# EAGLE design BrewPi Shield (EAGLE 9.4.2)
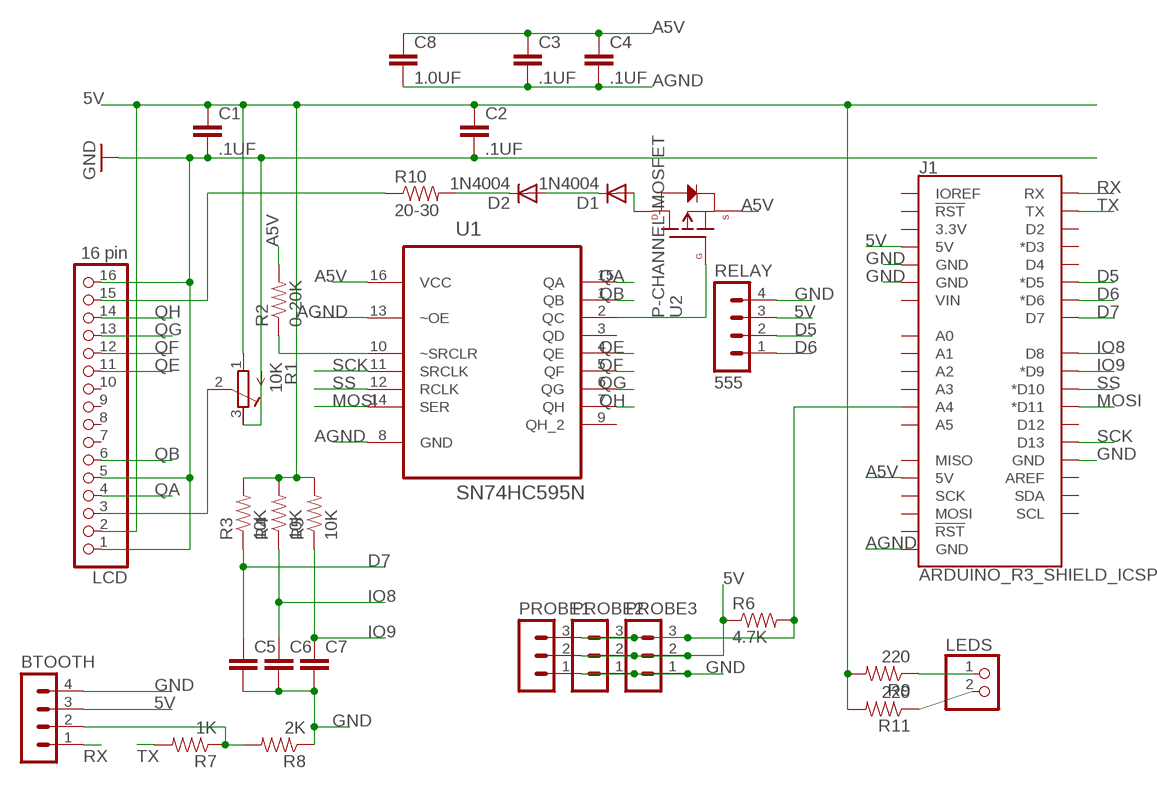
[diagram p0: schematic, sheet 1]

## Parts
BTOOTH  MA04-1  [MA04-1]
C1  .1UF  CAPKIT  [CAP-PTH-SMALL-KIT]
C2  .1UF  CAPKIT  [CAP-PTH-SMALL-KIT]
C3  .1UF  CAPKIT  [CAP-PTH-SMALL-KIT]
C4  .1UF  CAPKIT  [CAP-PTH-SMALL-KIT]
C5  CAPKIT  [CAP-PTH-SMALL-KIT]
C6  CAPKIT  [CAP-PTH-SMALL-KIT]
C7  CAPKIT  [CAP-PTH-SMALL-KIT]
C8  1.0UF  CAPKIT  [CAP-PTH-SMALL-KIT]
D1  1N4004  [DO41-10]
D2  1N4004  [DO41-10]
J1  ARDUINO_R3_SHIELD_ICSP  [UNO_R3_SHIELD_ICSP]
LCD  16 pin  PINHD-1X16  [1X16]
LEDS  PINHD-1X2  [1X02]
PROBE1  MA03-1  [MA03-1]
PROBE2  MA03-1  [MA03-1]
PROBE3  MA03-1  [MA03-1]
R1  10K  R-TRIMM3296Y  [RTRIM3296Y]
R2  0-20K  RESISTORAXIAL-0.3  [AXIAL-0.3]
R3  10K  RESISTORAXIAL-0.3  [AXIAL-0.3]
R4  10K  RESISTORAXIAL-0.3  [AXIAL-0.3]
R5  10K  RESISTORAXIAL-0.3  [AXIAL-0.3]
R6  4.7K  RESISTORAXIAL-0.3  [AXIAL-0.3]
R7  1K  RESISTORAXIAL-0.3  [AXIAL-0.3]
R8  2K  RESISTORAXIAL-0.3  [AXIAL-0.3]
R9  220  RESISTORAXIAL-0.3  [AXIAL-0.3]
R10  20-30  RESISTORPTH-1/2W  [AXIAL-0.5]
R11  220  RESISTORAXIAL-0.3  [AXIAL-0.3]
RELAY  555  MA04-1  [MA04-1]
U1  SN74HC595N  [DIP254P762X508-16]
U2  P-CHANNEL-MOSFET  [SOT23-3]

## Nets
5V: BTOOTH.3 C1.1 C2.1 J1.5V LCD.2 PROBE1.2 PROBE2.2 PROBE3.2 R1.1(A) R3.P$2 R4.P$2 R5.P$2 R6.P$1 R9.P$2 R11.P$2 RELAY.3
A5V: C3.1 C4.1 C8.1 J1.5V_ICSP(5V) R2.P$2 U1.16(VCC) U2.2(S)
AGND: C3.2 C4.2 C8.2 J1.GND_ICSP(GND) U1.8(GND) U1.13(~OE)
D5: J1.D5(*D5) RELAY.2
D6: J1.D6(*D6) RELAY.1
D7: C5.1 J1.D7 R3.P$1
GND: BTOOTH.4 C1.2 C2.2 C5.2 C6.2 C7.2 J1.GND@0(GND) J1.GND@1(GND) J1.GND@2(GND) LCD.1 LCD.5 LCD.16 PROBE1.1 PROBE2.1 PROBE3.1 R1.3(E) R8.P$1 RELAY.4
IO8: C6.1 J1.D8 R4.P$1
IO9: C7.1 J1.D9(*D9) R5.P$1
MOSI: J1.D11(*D11) U1.14(SER)
N$1: R2.P$1 U1.10(~SRCLR)
N$2: U1.2(QC) U2.1(G)
N$3: BTOOTH.2 R7.P$1 R8.P$2
N$4: J1.A4 PROBE1.3 PROBE2.3 PROBE3.3 R6.P$2
N$5: D1.C D2.A
N$6: LCD.3 R1.2(S)
N$9: D2.C R10.P$2
N$10: LCD.15 R10.P$1
N$11: D1.A U2.3(D)
N$12: LEDS.1 R9.P$1
N$13: LEDS.2 R11.P$1
QA: LCD.4 U1.15(QA)
QB: LCD.6 U1.1(QB)
QE: LCD.11 U1.4(QE)
QF: LCD.12 U1.5(QF)
QG: LCD.13 U1.6(QG)
QH: LCD.14 U1.7(QH)
RX: BTOOTH.1 J1.RX
SCK: J1.D13 U1.11(SRCLK)
SS: J1.D10(*D10) U1.12(RCLK)
TX: J1.TX R7.P$2
Unconnected: J1.3.3V J1.A0 J1.A1 J1.A2 J1.A3 J1.A5 J1.AREF J1.D2 J1.D3(*D3) J1.D4 J1.D12 J1.IOREF J1.MISO J1.MOSI J1.RES(!RST!) J1.RST_ICSP(!RST!) J1.SCK J1.SCL J1.SDA J1.VIN LCD.7 LCD.8 LCD.9 LCD.10 U1.3(QD) U1.9(QH_2)

## Library data of the parts
BTOOTH RELAY = con-lstb:MA04-1: PIN HEADER; OC_FARNELL: unknown; OC_NEWARK: unknown
C1-C8 = SparkFun-Capacitors:CAP: Capacitor Standard 0603 ceramic capacitor, and 0.1" leaded capacitor.
D1 D2 = diode:1N4004: DIODE general purpose rectifier, 1 A
J1 = SparkFun-Boards:ARDUINO_R3_SHIELD_ICSP: Arduino R3 Shield Footprint w/ 6-pin (2x3) ICSP Header
LCD = pinhead:PINHD-1X16: PIN HEADER
LEDS = pinhead:PINHD-1X2: PIN HEADER
PROBE1-PROBE3 = con-lstb:MA03-1: PIN HEADER; OC_FARNELL: unknown; OC_NEWARK: unknown
R1 = rcl:R-TRIMM: Trimm resistor
R2-R11 = SparkFun-Passives:RESISTOR: Resistor Basic schematic elements and footprints for 0603, 1206, and PTH resistors.
U1 = Texas Instruments_By_element14_Batch_1:SN74HC595N: 8-BIT SHIFT REGISTERS WITH 3-STATE OUTPUT REGISTERS; MPN: SN74HC595N; OC_FARNELL: 9591664; OC_NEWARK: 60K6845; PACKAGE: PDIP-16; SUPPLIER: Texas Instruments
U2 = GeekAmmo:P-CHANNEL-MOSFET: P-Channel MOSFET Mode Field Effect Transistor

## Board
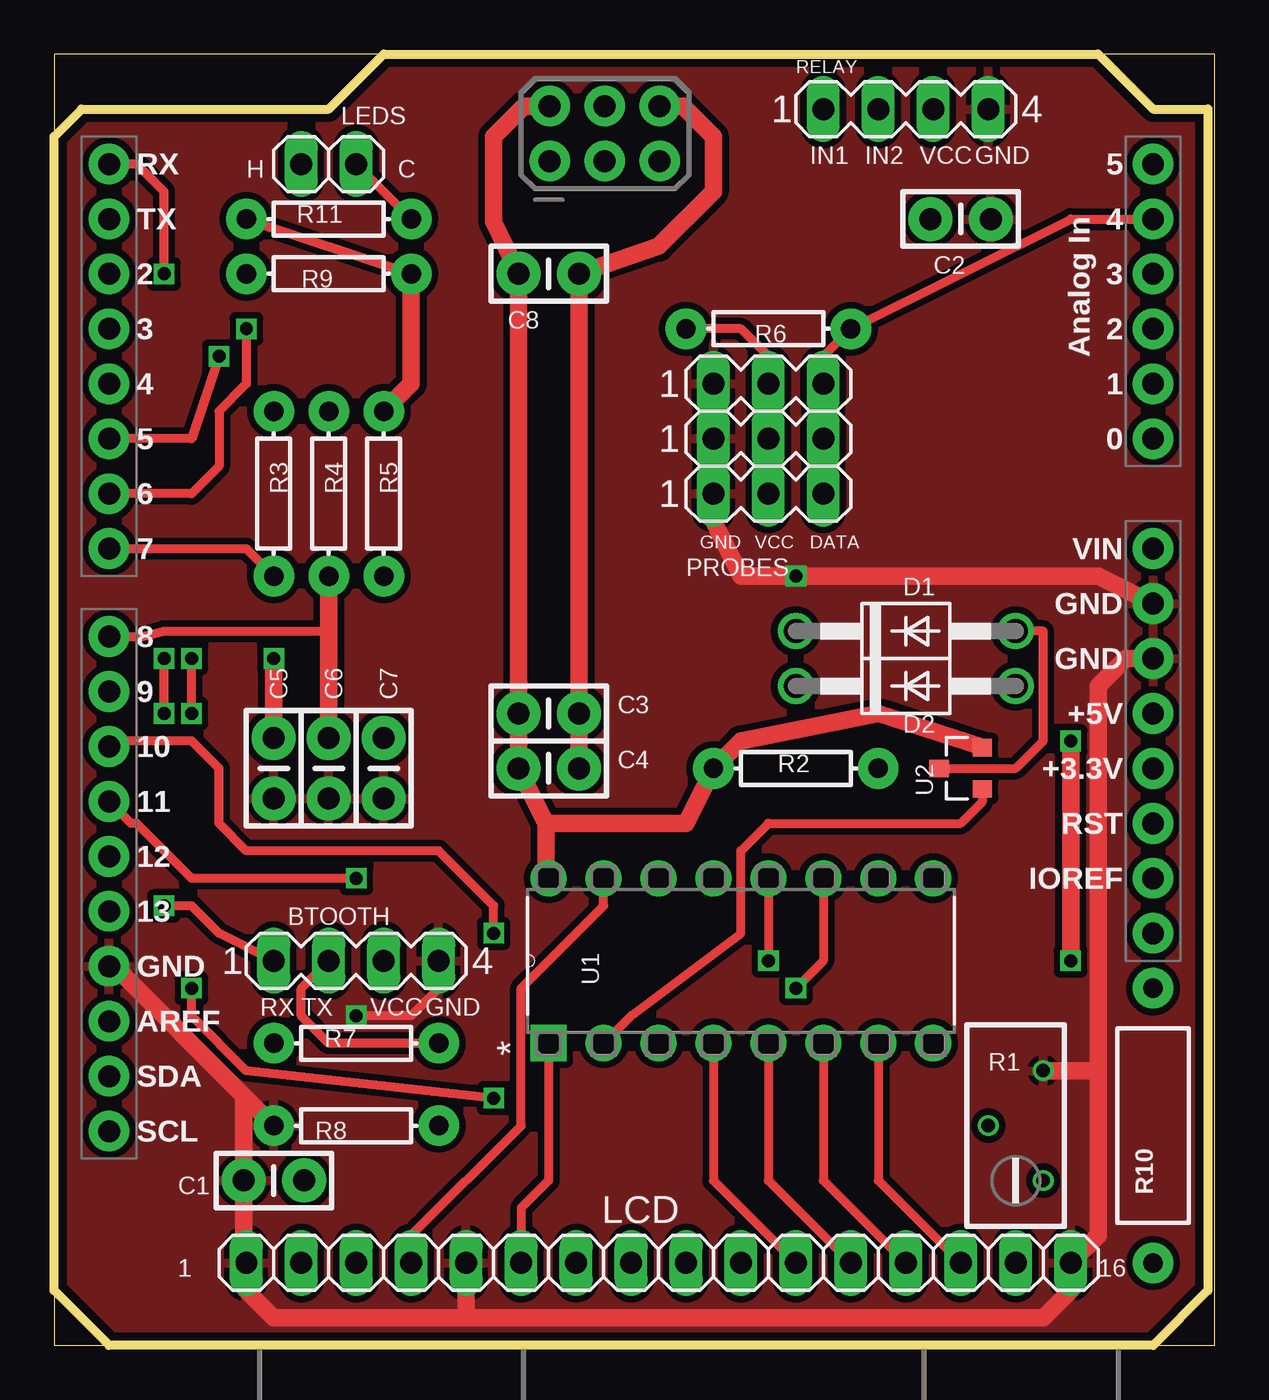
[diagram p1: board, top side]
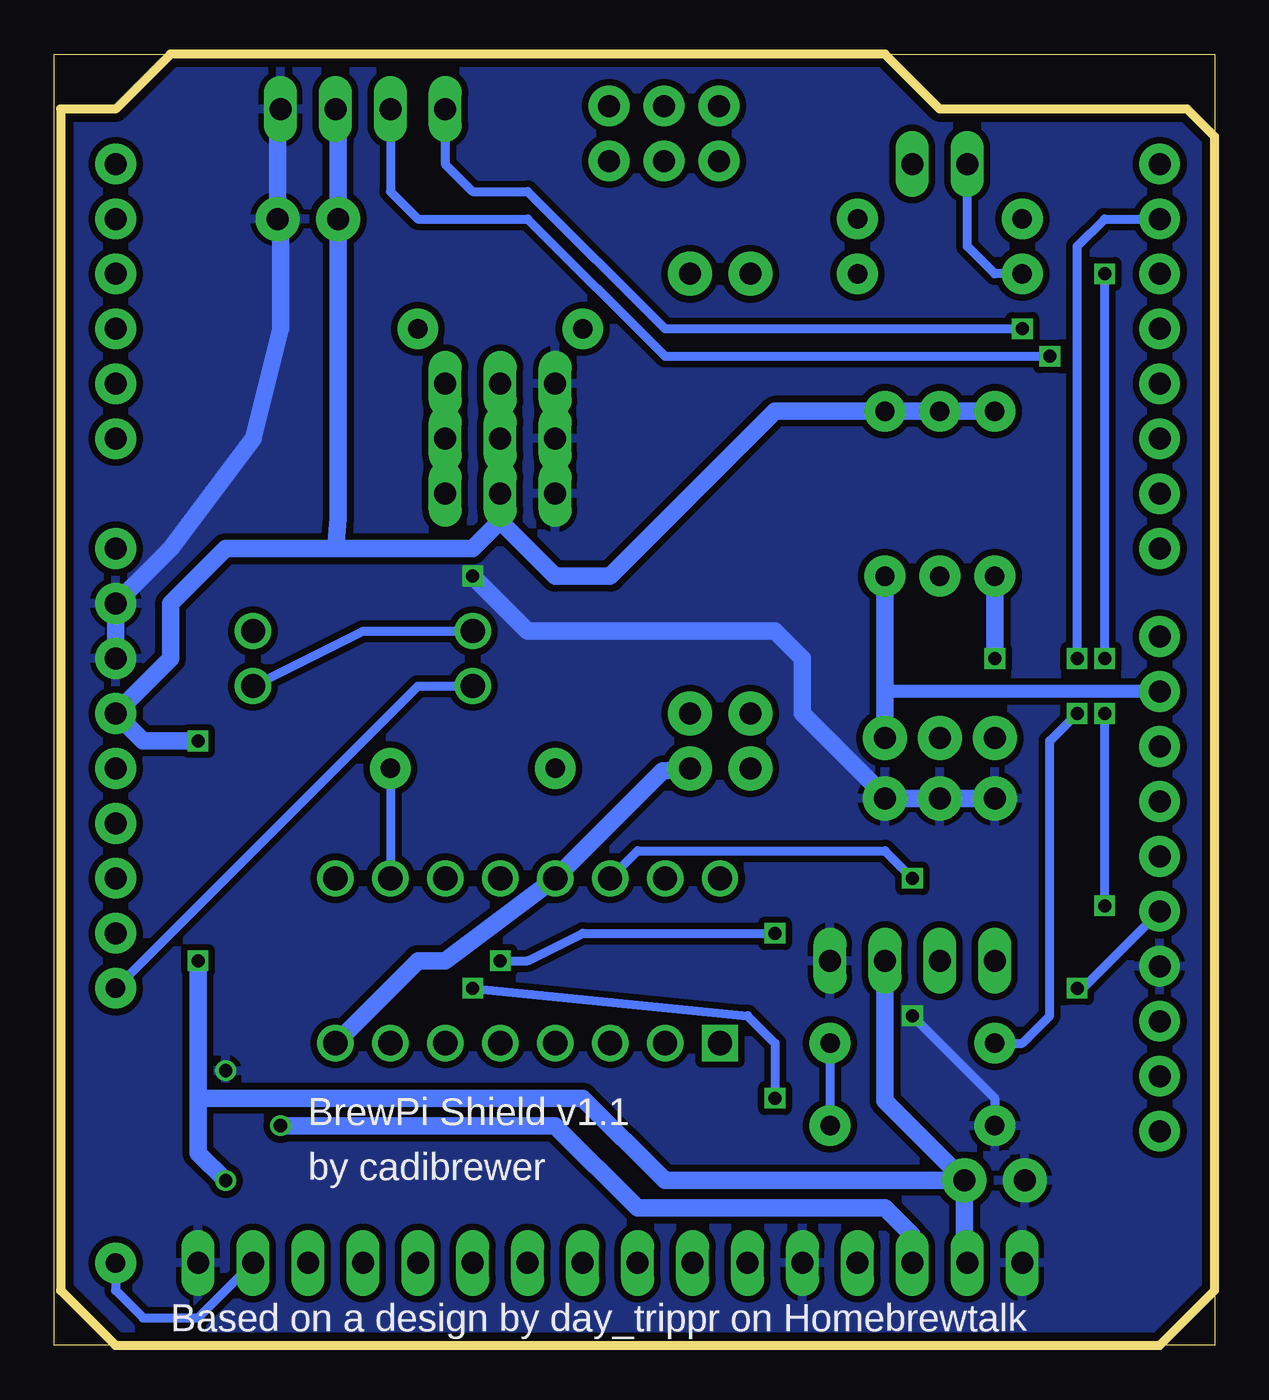
[diagram p2: board, bottom side, seen from below]

Size 53.65 x 59.69 mm. Coordinates in mm from the lower left corner, seen from the top.
Outline: 0,0 53.65,0 53.65,59.68 0,59.68 0,0
Outline: 0,2.54 0,55.88 1.27,57.15 12.7,57.15 15.24,59.69 48.26,59.69 50.8,57.15 53.34,57.15 53.34,2.54 50.8,0 2.54,0 0,2.54
Copper layers (1*16): Top 0.0356mm / dielectric 1.5011mm / Bottom 0.0356mm
Design rules "LaenPCBOrder": minimum track width 6mil, minimum drill 13mil, track to track 6mil, track to pad 6mil, pad to pad 6mil, via to via 6mil, smd to smd 6mil, copper to edge 15mil, drill to drill 6mil, minimum pad ring 7mil, minimum via ring 7mil, stop-mask expansion 3mil, vias tented up to drill 0mil, thermal gap 10mil

### Footprints (pad centres in the part's own frame; a part is rotated, then mirrored left to right if it is on the bottom)
MA04-1 = drill 1.016 long: 1 -3.81,0; 2 -1.27,0; 3 1.27,0; 4 3.81,0
CAP-PTH-SMALL-KIT = drill 1.016 pad 2.032: 1 -1.397,0; 2 1.397,0
DO41-10 = drill 1.118: A 5.08,0; C -5.08,0
UNO_R3_SHIELD_ICSP = drill 1.016 pad 1.88: 3.3V 50.8,26.67; 5V 50.8,29.21; 5V_ICSP 22.91,57.29; A0 50.8,41.91; A1 50.8,44.45; A2 50.8,46.99; A3 50.8,49.53; A4 50.8,52.07; A5 50.8,54.61; AREF 2.54,14.986; D2 2.54,49.53; D3 2.54,46.99; D4 2.54,44.45; D5 2.54,41.91; D6 2.54,39.37; D7 2.54,36.83; D8 2.54,32.766; D9 2.54,30.226; D10 2.54,27.686; D11 2.54,25.146; D12 2.54,22.606; D13 2.54,20.066; GND@0 50.8,31.75; GND@1 50.8,34.29; GND@2 2.54,17.526; GND_ICSP 27.99,57.29; IOREF 50.8,21.59; MISO 22.91,54.75; MOSI 25.45,57.29; NC 50.8,19.05; RES 50.8,24.13; RST_ICSP 27.99,54.75; RX 2.54,54.61; SCK 25.45,54.75; SCL 2.54,9.906; SDA 2.54,12.446; TX 2.54,52.07; VIN 50.8,36.83
1X16 = drill 1.016 long: 1 -19.05,0; 2 -16.51,0; 3 -13.97,0; 4 -11.43,0; 5 -8.89,0; 6 -6.35,0; 7 -3.81,0; 8 -1.27,0; 9 1.27,0; 10 3.81,0; 11 6.35,0; 12 8.89,0; 13 11.43,0; 14 13.97,0; 15 16.51,0; 16 19.05,0
1X02 = drill 1.016 long: 1 -1.27,0; 2 1.27,0
MA03-1 = drill 1.016 long: 1 -2.54,0; 2 0,0; 3 2.54,0
RTRIM3296Y = drill 0.61: 1 1.27,-2.54; 2 -1.27,0; 3 1.27,2.54
AXIAL-0.3 = drill 0.9 pad 1.88: P$1 -3.81,0; P$2 3.81,0
AXIAL-0.5 = drill 0.9 pad 1.88: P$1 -6.35,0; P$2 6.35,0
DIP254P762X508-16 = drill 1.118 square: 1 -7.62,17.78 | drill 1.118: 2 -7.62,15.24; 3 -7.62,12.7; 4 -7.62,10.16; 5 -7.62,7.62; 6 -7.62,5.08; 7 -7.62,2.54; 8 -7.62,0; 9 0,0; 10 0,2.54; 11 0,5.08; 12 0,7.62; 13 0,10.16; 14 0,12.7; 15 0,15.24; 16 0,17.78
SOT23-3 = smd 0.8 x 0.9: 1 -0.95,-1; 2 0.95,-1; 3 0,1

### Placement (x,y rotation side)
BTOOTH  13.97,17.78 0 top
C1  10.16,7.62 180 top
C2  41.91,52.07 0 top
C3  22.86,29.21 0 top
C4  22.86,26.67 0 top
C5  10.16,26.67 270 top
C6  12.7,26.67 270 top
C7  15.24,26.67 270 top
C8  22.86,49.53 0 top
D1  39.37,33.02 0 top
D2  39.37,30.48 0 top
J1  0,0 0 top
LCD  27.94,3.81 0 top
LEDS  12.7,54.61 0 top
PROBE1  33.02,44.45 0 top
PROBE2  33.02,41.91 0 top
PROBE3  33.02,39.37 0 top
R1  44.45,10.16 0 top
R2  34.29,26.67 180 top
R3  10.16,39.37 90 top
R4  12.7,39.37 90 top
R5  15.24,39.37 90 top
R6  33.02,46.99 0 top
R7  13.97,13.97 180 top
R8  13.97,10.16 0 top
R9  12.7,49.53 0 top
R10  50.8,10.16 90 top
R11  12.7,52.07 180 top
RELAY  39.37,57.15 0 top
U1  40.64,21.59 90 top
U2  41.91,26.67 90 top

### Tracks (layer width: path | path; a pad name or v marks a point on that pad's centre or on a via)
5V  (via drill 0.6)
  Top 0.406: PROBE3.2 PROBE2.2 PROBE1.2 33.02,45.72 31.75,46.99 R6.P$1 | R11.P$2 R9.P$2
  Top 0.813: v46.99,17.78 v46.99,27.94 | R9.P$2 16.51,44.45 R5.P$2
  Bottom 0.406: 11.56,3.94 LCD.2
  Bottom 0.813: 40.64,36.83 45.72,36.83 48.26,34.29 48.26,31.75 J1.5V 49.53,27.94 v46.99,27.94 | 40.64,36.83 34.29,36.83 33.02,38.1 | 40.64,36.83 40.51,38.23 C2.1 40.51,55.75 RELAY.3 | R1.1 46.99,8.89 46.99,11.43 | 46.99,11.43 v46.99,17.78 | PROBE3.2 33.02,38.1 | C1.1 25.4,7.62 29.21,11.43 46.99,11.43 | BTOOTH.3 15.24,11.3 C1.1 | C1.1 11.56,3.94 | 33.02,38.1 30.48,35.56 27.94,35.56 20.32,43.18 R5.P$2 R4.P$2 R3.P$2
A5V
  Top 0.406: 22.73,21.72 U1.16 | U2.2 42.91,27.67
  Top 0.813: J1.5V_ICSP 21.73,57.29 20.32,55.88 20.32,51.94 C8.1 C3.1 C4.1 22.73,24.13 | 22.73,24.13 22.73,21.72 | 22.73,24.13 29.21,24.13 R2.P$2 31.75,27.94 38.1,29.21 42.91,27.67
AGND
  Top 0.813: J1.GND_ICSP 29.07,57.29 30.48,55.88 30.48,53.34 27.94,50.8 C8.2 C3.2 C4.2
  Bottom 0.813: C4.2 25.53,26.54 U1.13 35.56,17.78 36.83,17.78 U1.8
D5  (via drill 0.6)
  Top 0.406: v7.62,45.72 6.35,41.91 J1.D5
  Bottom 0.406: RELAY.2 38.1,53.34 36.83,52.07 31.75,52.07 25.4,45.72 v7.62,45.72
D6  (via drill 0.6)
  Top 0.406: v8.89,46.99 8.89,44.45 7.62,43.18 7.62,40.64 6.35,39.37 J1.D6
  Bottom 0.406: RELAY.1 35.56,54.61 34.29,53.34 31.75,53.34 25.4,46.99 v8.89,46.99
D7  (via drill 0.6)
  Top 0.406: J1.D7 8.89,36.83 R3.P$1
  Top 0.813: C5.1 v10.16,31.75
  Bottom 0.813: R3.P$1 v10.16,31.75
GND  (via drill 0.6)
  Top 0.406: RELAY.4 43.31,55.88 | PROBE3.1 PROBE2.1 PROBE1.1 | BTOOTH.4 17.78,16.51 16.51,15.24 v13.97,15.24
  Top 0.813: J1.GND@0 49.53,31.75 48.26,30.48 48.26,12.7 | 48.26,12.7 48.26,5.08 LCD.16 46.99,2.54 45.72,1.27 19.05,1.27 | 19.05,1.27 10.16,1.27 8.89,2.54 LCD.1 8.76,3.94 C1.2 8.76,11.3 8.89,11.43 | LCD.5 19.05,1.27 | R1.3 48.26,12.7 | PROBE1.1 30.48,38.1 31.75,35.56 v34.29,35.56 48.26,35.56 J1.GND@1 | J1.GND@2 2.79,17.53 8.89,11.43 | 8.89,11.43 R8.P$1
  Bottom 0.406: 8.76,3.94 LCD.1 | v13.97,15.24 10.16,11.43 R8.P$1
  Bottom 0.813: RELAY.4 43.31,55.75 C2.2 43.18,51.94 43.18,46.99 44.45,41.91 48.26,36.83 J1.GND@1 J1.GND@0 | v34.29,35.56 31.75,33.02 20.32,33.02 19.05,31.75 19.05,29.21 15.24,25.4 C7.2 C6.2 C5.2
  pour Top (isolate 0.305): 0,2.54 0,55.88 1.27,57.15 12.7,57.15 15.24,59.69 48.26,59.69 50.8,57.15 53.34,57.15 53.34,2.54 50.8,0 2.54,0
  pour Bottom (isolate 0.305): 0,2.54 0,55.88 1.27,57.15 12.7,57.15 15.24,59.69 48.26,59.69 50.8,57.15 53.34,57.15 53.34,2.54 50.8,0 2.54,0
IO8
  Top 0.406: J1.D8 4.06,32.77 5.08,33.02 12.7,33.02
  Top 0.813: R4.P$1 12.7,33.02 C6.1
IO9
  Bottom 0.406: 14.99,30.23 15.24,30.48
  Bottom 0.61: J1.D9 14.99,30.23
  Bottom 0.813: R5.P$1 15.24,30.48 C7.1
MOSI  (via drill 0.6)
  Top 0.406: v13.97,21.59 6.35,21.59 3.81,24.13 3.56,24.13 J1.D11
  Bottom 0.406: U1.14 26.67,22.86 15.24,22.86 v13.97,21.59
N$1
  Bottom 0.406: R2.P$1 U1.10
N$2
  Top 0.406: U1.2 26.67,15.24 31.75,19.05 31.75,22.86 33.02,24.13 41.91,24.13 42.91,25.13 U2.1
N$3
  Top 0.406: R7.P$1 12.7,13.97 11.43,15.24 11.43,16.51 BTOOTH.2
  Bottom 0.406: R7.P$1 R8.P$2
N$4
  Top 0.406: J1.A4 46.99,52.07 R6.P$2 35.56,45.72 PROBE1.3 PROBE2.3 PROBE3.3
N$5
  Bottom 0.406: D2.A 39.37,33.02 D1.C
N$6
  Bottom 0.813: R1.2 30.48,10.16 26.67,6.35 15.24,6.35 13.97,5.08 LCD.3
N$9
  Bottom 0.406: R10.P$2 36.83,30.48 D2.C
N$10
  Bottom 0.406: R10.P$1 50.8,2.54 49.53,1.27 46.99,1.27 LCD.15
N$11
  Top 0.406: 40.64,26.67 U2.3 44.45,26.67 45.72,27.94 45.72,33.02 D1.A
N$12
  Bottom 0.406: R9.P$1 10.16,49.53 11.43,50.8 LEDS.1
N$13
  Top 0.406: LEDS.2 R11.P$1
QA
  Top 0.406: LCD.4 16.51,5.08 21.59,10.16 21.59,16.51 25.4,20.32 U1.15
QB
  Top 0.406: U1.1 22.86,7.62 21.59,6.35 LCD.6
QE
  Top 0.406: U1.4 30.48,7.62 LCD.11
QF
  Top 0.406: U1.5 33.02,7.62 LCD.12
QG
  Top 0.406: U1.6 35.56,7.62 LCD.13
QH
  Top 0.406: U1.7 38.1,7.62 LCD.14
RX  (via drill 0.6)
  Top 0.406: BTOOTH.1 7.62,19.05 6.35,20.32 v5.08,20.32 | v5.08,29.21 v5.08,31.75 | v5.08,49.53 5.08,53.34 3.81,54.61 J1.RX
  Bottom 0.406: v5.08,20.32 v5.08,29.21 | v5.08,31.75 v5.08,49.53
SCK  (via drill 0.6)
  Top 0.406: v20.32,11.43 8.89,12.7 6.35,15.24 v6.35,16.51 | U1.11 35.56,17.78 v34.29,16.51
  Bottom 0.406: v6.35,16.51 6.1,16.51 J1.D13 | v34.29,16.51 21.59,15.24 20.32,13.97 v20.32,11.43
SS  (via drill 0.6)
  Top 0.406: U1.12 v33.02,17.78 | v20.32,19.05 20.32,20.32 17.78,22.86 8.89,22.86 7.62,24.13 7.62,26.67 6.35,27.94 2.79,27.94 J1.D10
  Bottom 0.406: v33.02,17.78 31.75,17.78 29.21,19.05 v20.32,19.05
TX  (via drill 0.6)
  Top 0.406: v6.35,29.21 v6.35,31.75
  Bottom 0.406: R7.P$2 8.89,13.97 7.62,15.24 7.62,27.94 v6.35,29.21 | v6.35,31.75 6.35,50.8 5.08,52.07 J1.TX

### Text on the board
tNames: IN1 | IN2 | VCC | GND | H | C | C2 | C8 | GND | VCC | DATA | PROBES | C5 | C6 | C7 | C3 | C4 | RX | TX | VCC | GND | R1 | C1 | 1 | 16
bNames: BrewPi Shield v1.1 | by cadibrewer | Based on a design by day_trippr on Homebrewtalk